# Altium schematic sheet RS232.SchDoc
size A4
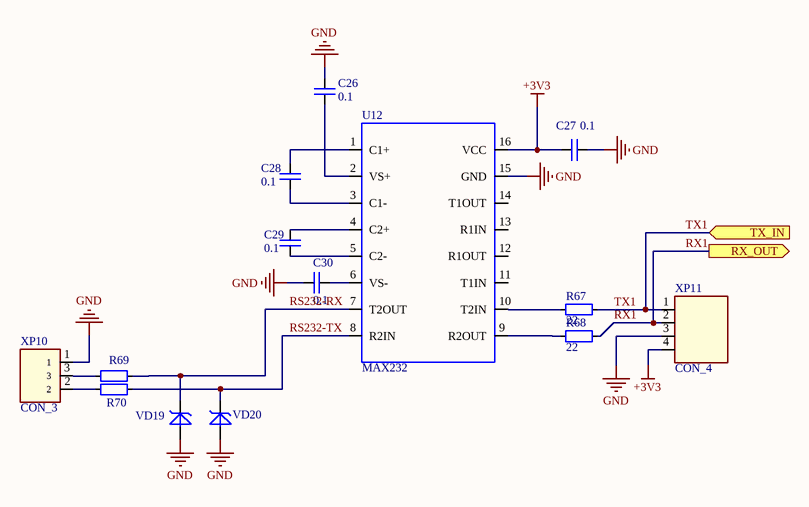
[diagram p0: RS232.SchDoc]

## Parts
C26  0.1  [SMD_0805]
C27  0.1  [SMD_0805]
C28  0.1  [SMD_0805]
C29  0.1  [SMD_0805]
C30  0.1  [SMD_0805]
R67  22  [SMD_0805]
R68  22  [SMD_0805]
R69  (no value)  [SMD_0805]
R70  (no value)  [SMD_0805]
U12  MAX232  [SOIC-16]
VD19  (no value)  [DO214-AC]
VD20  (no value)  [DO214-AC]
XP10  CON_3  [MW-3M-2.0]
XP11  CON_4  [HEAD-1/4/2.54]

## Ports
RX_OUT (out), TX_IN (in)

## Nets
+3V3: C27.1 U12.16(VCC) XP11.4
GND: C26.2 C27.2 C30.2 U12.15(GND) VD19.2 VD20.2 XP10.1 XP11.3
RS232-RX: R69.1 U12.7(T2OUT) VD19.1
RS232-TX: R70.1 U12.8(R2IN) VD20.1
RX1: R68.1 XP11.2 ; port RX_OUT
TX1: R67.1 XP11.1 ; port TX_IN
NetC26_1: C26.1 U12.2(VS+)
NetC28_1: C28.1 U12.1(C1+)
NetC28_2: C28.2 U12.3(C1-)
NetC29_1: C29.1 U12.4(C2+)
NetC29_2: C29.2 U12.5(C2-)
NetC30_1: C30.1 U12.6(VS-)
NetR67_2: R67.2 U12.10(T2IN)
NetR68_2: R68.2 U12.9(R2OUT)
NetR69_2: R69.2 XP10.3
NetR70_2: R70.2 XP10.2

Not connected (* = marked no-connect by the designer): U12 11(T1IN) 12(R1OUT) 13(R1IN) 14(T1OUT)

## Library data of the parts
C26-C30 = C_NONE_POLAR: None polar capacitor; Value: 0.1; Case: *
R67-R70 = RES: Resistor
  R67 R68: Value: 22; Case: 0805
  R69 R70: Case: *
U12 = MAX232: RS232 transceiver
VD19 VD20 = DIOSE_TVS: TVS Diode